# EAGLE design Timer-Ruler_v2 (EAGLE 7.4.0)
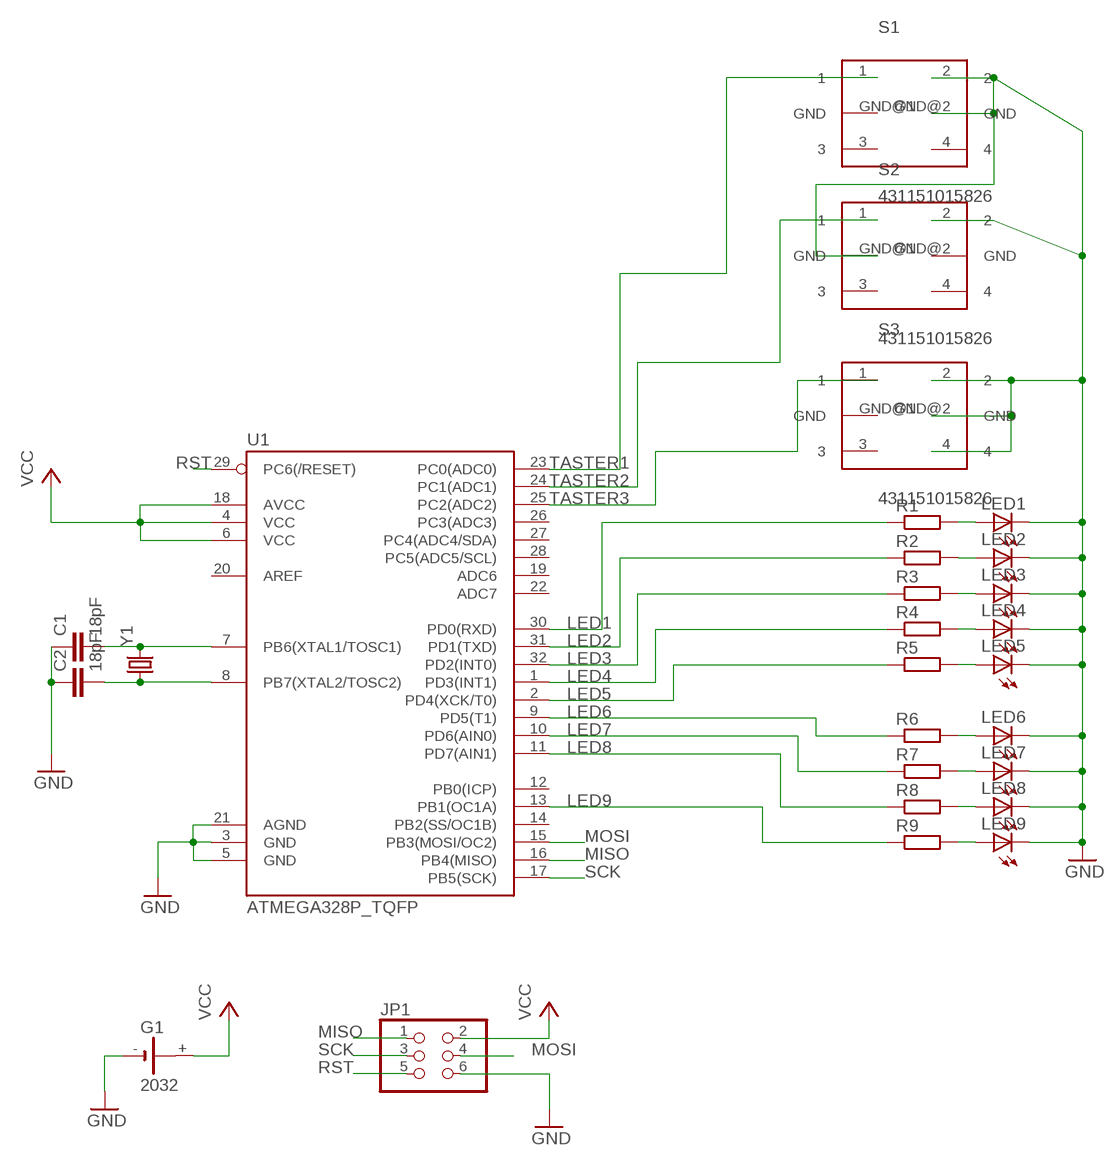
[diagram p0: schematic, sheet 1]

## Parts
C1  18pF  C-EUC0805K  [C0805K]
C2  18pF  C-EUC0805K  [C0805K]
G1  2032  [KZH20SMD]
JP1  PINHD-2X3  [2X03]
LED1  LEDCHIP-LED0805  [CHIP-LED0805]
LED2  LEDCHIP-LED0805  [CHIP-LED0805]
LED3  LEDCHIP-LED0805  [CHIP-LED0805]
LED4  LEDCHIP-LED0805  [CHIP-LED0805]
LED5  LEDCHIP-LED0805  [CHIP-LED0805]
LED6  LEDCHIP-LED0805  [CHIP-LED0805]
LED7  LEDCHIP-LED0805  [CHIP-LED0805]
LED8  LEDCHIP-LED0805  [CHIP-LED0805]
LED9  LEDCHIP-LED0805  [CHIP-LED0805]
R1  R-EU_R0805  [R0805]
R2  R-EU_R0805  [R0805]
R3  R-EU_R0805  [R0805]
R4  R-EU_R0805  [R0805]
R5  R-EU_R0805  [R0805]
R6  R-EU_R0805  [R0805]
R7  R-EU_R0805  [R0805]
R8  R-EU_R0805  [R0805]
R9  R-EU_R0805  [R0805]
S1  431151015826  [431181015816]
S2  431151015826  [431181015816]
S3  431151015826  [431181015816]
U1  ATMEGA328P_TQFP  [TQFP32-08]
Y1  CRYSTALSMD  [HC49UP]

## Nets
GND: C1.1 C2.1 G1.- JP1.6 LED1.C LED2.C LED3.C LED4.C LED5.C LED6.C LED7.C LED8.C LED9.C S1.2 S1.GND@2(GND) S2.2 S2.GND@1(GND) S3.2 S3.4 S3.GND@2(GND) U1.3(GND) U1.5(GND) U1.21(AGND)
LED1: R1.1 U1.30(PD0(RXD))
LED2: R2.1 U1.31(PD1(TXD))
LED3: R3.1 U1.32(PD2(INT0))
LED4: R4.1 U1.1(PD3(INT1))
LED5: R5.1 U1.2(PD4(XCK/T0))
LED6: R6.1 U1.9(PD5(T1))
LED7: R7.1 U1.10(PD6(AIN0))
LED8: R8.1 U1.11(PD7(AIN1))
LED9: R9.1 U1.13(PB1(OC1A))
MISO: JP1.1 U1.16(PB4(MISO))
MOSI: JP1.4 U1.15(PB3(MOSI/OC2))
N$1: LED1.A R1.2
N$2: LED2.A R2.2
N$3: LED3.A R3.2
N$4: LED4.A R4.2
N$5: LED5.A R5.2
N$6: LED6.A R6.2
N$7: LED7.A R7.2
N$8: LED8.A R8.2
N$9: LED9.A R9.2
N$10: C1.2 U1.7(PB6(XTAL1/TOSC1)) Y1.2
N$11: C2.2 U1.8(PB7(XTAL2/TOSC2)) Y1.1
RST: JP1.5 U1.29(PC6(/RESET))
SCK: JP1.3 U1.17(PB5(SCK))
TASTER1: S1.1 U1.23(PC0(ADC0))
TASTER2: S2.1 U1.24(PC1(ADC1))
TASTER3: S3.1 U1.25(PC2(ADC2))
VCC: G1.+ JP1.2 U1.4(VCC) U1.6(VCC) U1.18(AVCC)
Unconnected: S1.3 S1.4 S1.GND@1(GND) S2.3 S2.4 S2.GND@2(GND) S3.3 S3.GND@1(GND) U1.12(PB0(ICP)) U1.14(PB2(SS/OC1B)) U1.19(ADC6) U1.20(AREF) U1.22(ADC7) U1.26(PC3(ADC3)) U1.27(PC4(ADC4/SDA)) U1.28(PC5(ADC5/SCL))

## Library data of the parts
C1 C2 = resistor:C-EU: CAPACITOR, European symbol
G1 = kzh20_lithium_batterie_holder:2032
JP1 = pinhead:PINHD-2X3: PIN HEADER
LED1-LED9 = led:LED: LED OSRAM: - CHIPLED LG R971, LG N971, LY N971, LG Q971, LY Q971, LO R971, LY R971 LH N974, LH R974 LS Q976, LO Q976, LY Q976 LO Q996 - Hyper CHIPLED LW Q18S LB Q993, LB Q99A, LB R99A - SideLED LS A670, LO A670, LY A670, LG A670, LP A670 LB A673, LV A673, LT A673, LW A673 LH A674 LY A675 LS A676, LA A676, LO A676, LY A676, LW A676 LS A679, LY A679, LG A679 - Hyper Micro SIDELED® LS Y876, LA Y876, LO Y876, LY Y876 LT Y87S - SmartLED LW L88C, LW L88S LB L89C, LB L89S, LG L890 LS L89K, LO L89K, LY L89K LS L896, LA L896, LO L896, LY L896 - TOPLED LS T670, LO T670, LY T670, LG T670, LP T670 LSG T670, LSP T670, LSY T670, LOP T670, LYG T670 LG T671, LOG T671, LSG T671 LB T673, LV T673, LT T673, LW T673 LH T674 LS T676, LA T676, LO T676, LY T676, LB T676, LH T676, LSB T676, LW T676 LB T67C, LV T67C, LT T67C, LS T67K, LO T67K, LY T67K, LW E67C LS E67B, LA E67B, LO E67B, LY E67B, LB E67C, LV E67C, LT E67C LW T67C LS T679, LY T679, LG T679 LS T770, LO T770, LY T770, LG T770, LP T770 LB T773, LV T773, LT T773, LW T773 LH T774 LS E675, LA E675, LY E675, LS T675 LS T776, LA T776, LO T776, LY T776, LB T776 LHGB T686 LT T68C, LB T68C - Hyper Mini TOPLED® LB M676 - Mini TOPLED Santana® LG M470 LS M47K, LO M47K, LY M47K Source: http://www.osram.convergy.de LUXEON: - LUMILED® LXK2-PW12-R00, LXK2-PW12-S00, LXK2-PW14-U00, LXK2-PW14-V00 LXK2-PM12-R00, LXK2-PM12-S00, LXK2-PM14-U00 LXK2-PE12-Q00, LXK2-PE12-R00, LXK2-PE12-S00, LXK2-PE14-T00, LXK2-PE14-U00 LXK2-PB12-K00, LXK2-PB12-L00, LXK2-PB12-M00, LXK2-PB14-N00, LXK2-PB14-P00, LXK2-PB14-Q00 LXK2-PR12-L00, LXK2-PR12-M00, LXK2-PR14-Q00, LXK2-PR14-R00 LXK2-PD12-Q00, LXK2-PD12-R00, LXK2-PD12-S00 LXK2-PH12-R00, LXK2-PH12-S00 LXK2-PL12-P00, LXK2-PL12-Q00, LXK2-PL12-R00 Source: www.luxeon.com KINGBRIGHT: KA-3528ASYC Source: www.kingbright.com
R1-R9 = resistor:R-EU_: RESISTOR, European symbol
S1-S3 = Wurth_Elektronik_Electromechanic_Switchs_rev15b:431151015826: WS-TSS-5x5 mm SMD Tact Switch with ground terminal, 4 pins
U1 = SparkFun-DigitalIC:ATMEGA328P_TQFP; PROD_ID: IC-09069
Y1 = SparkFun-FreqCtrl:CRYSTAL: Various standard crystals. Proven footprints.

## Board
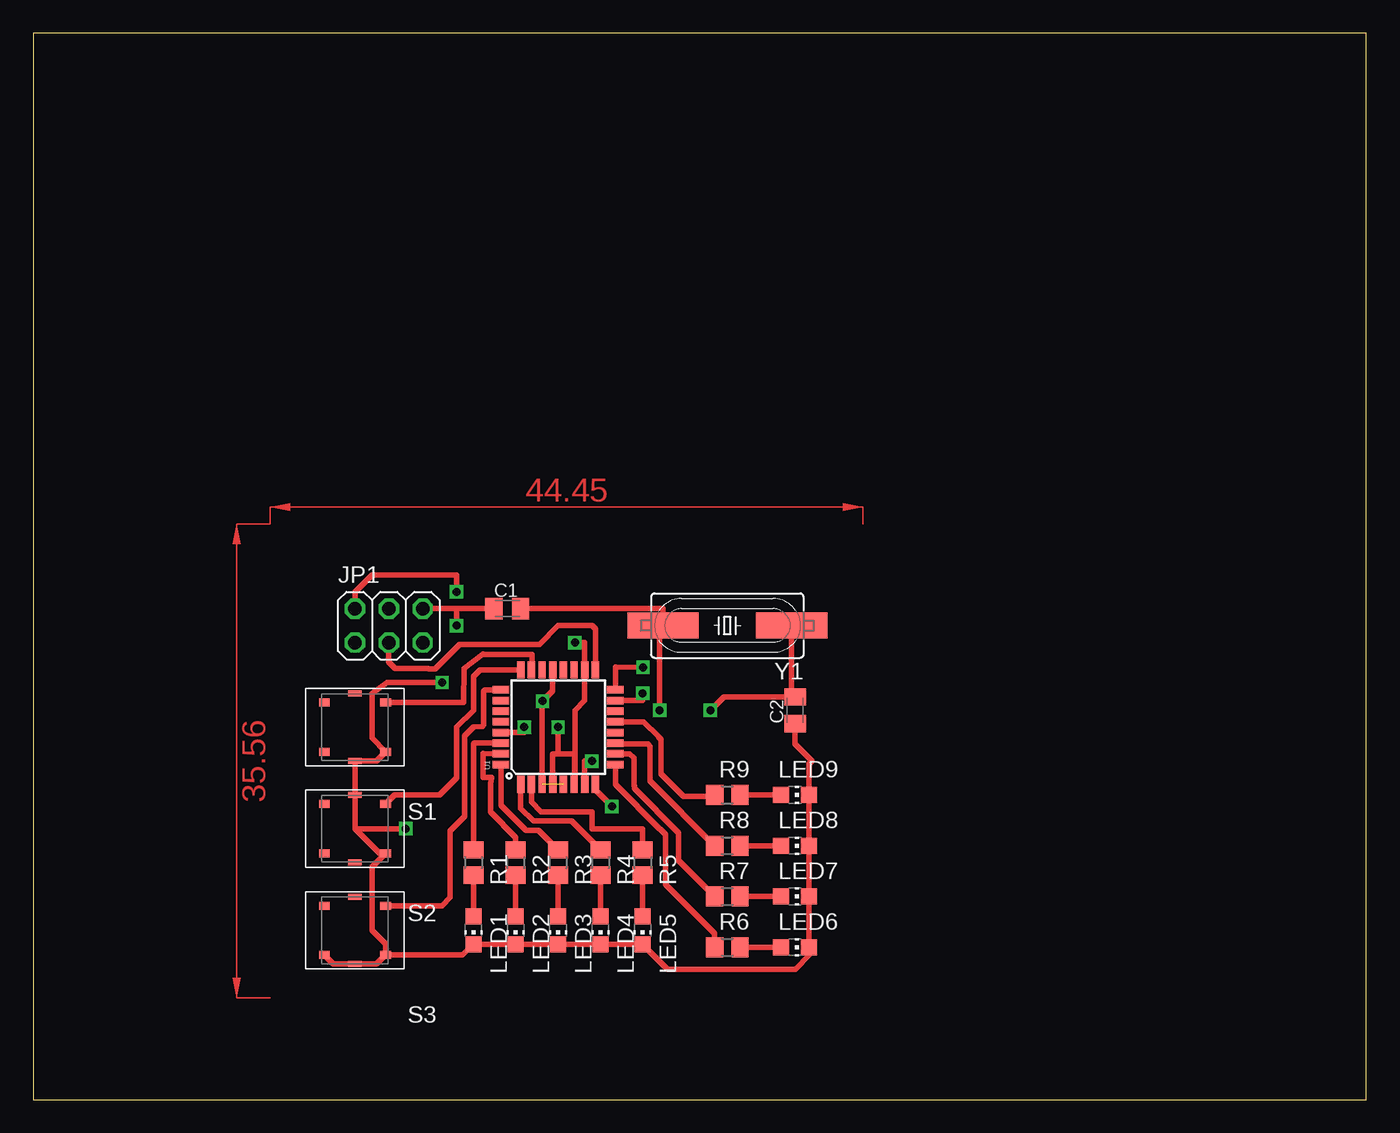
[diagram p1: board, top side]
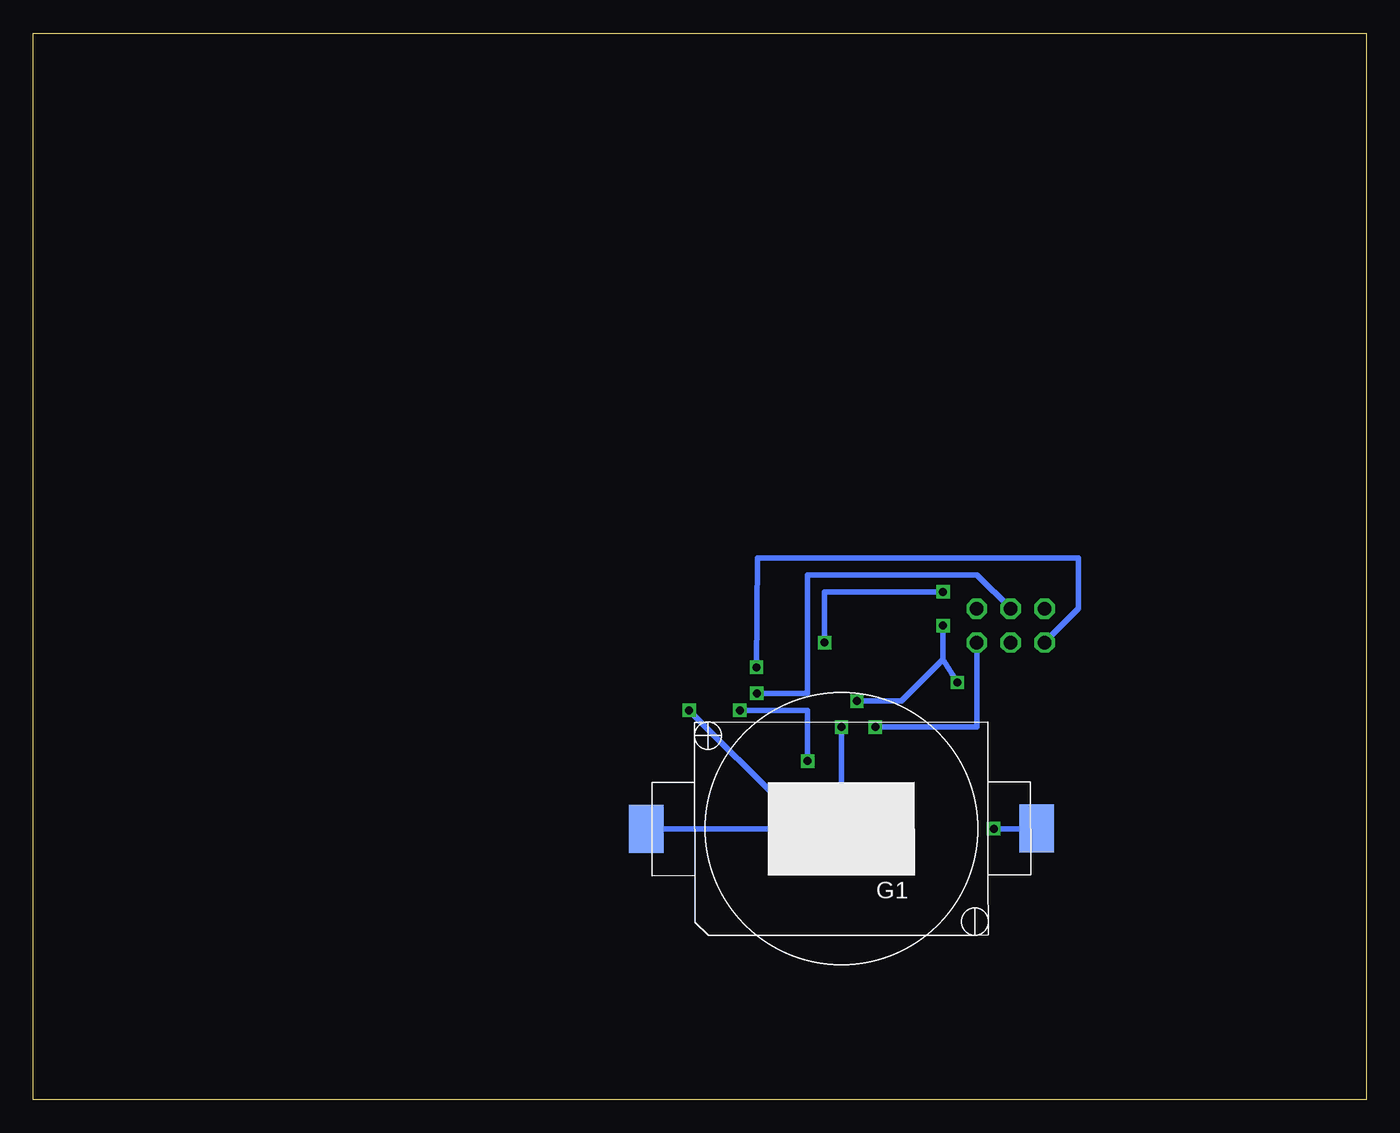
[diagram p2: board, bottom side, seen from below]

Size 100 x 80 mm. Coordinates in mm from the lower left corner, seen from the top.
Outline: 0,0 100,0 100,80 0,80 0,0
Copper layers (1*16): Top 0.035mm / dielectric 1.5mm / Bottom 0.035mm
Design rules "default *": minimum track width 0.4mm, minimum drill 24mil, track to track 0.4mm, track to pad 0.4mm, pad to pad 0.4mm, via to via 0.4mm, smd to smd 0.4mm, copper to edge 40mil, drill to drill 8mil, minimum pad ring 10mil, minimum via ring 8mil, stop-mask expansion 4mil, vias tented up to drill 0mil, thermal gap 10mil

### Footprints (pad centres in the part's own frame; a part is rotated, then mirrored left to right if it is on the bottom)
C0805K = smd 1.3 x 1.6: 1 -1,0; 2 1,0
KZH20SMD = smd 2.6 x 3.6: + 14.65,0; - -14.65,0
2X03 = drill 1.016 octagon: 1 -2.54,-1.27; 2 -2.54,1.27; 3 0,-1.27; 4 0,1.27; 5 2.54,-1.27; 6 2.54,1.27
CHIP-LED0805 = smd 1.2 x 1.2: A 0,-1.05; C 0,1.05
R0805 = smd 1.3 x 1.5: 1 -0.95,0; 2 0.95,0
431181015816 = smd 0.8 x 0.6: 1 -2.3,-1.85; 2 -2.3,1.85; 3 2.3,-1.85; 4 2.3,1.85 | smd 1 x 0.45: GND@1 0,-2.525; GND@2 0,2.525
TQFP32-08 = smd 1.27 x 0.559: 1 -4.293,2.8; 2 -4.293,2; 3 -4.293,1.2; 4 -4.293,0.4; 5 -4.293,-0.4; 6 -4.293,-1.2; 7 -4.293,-2; 8 -4.293,-2.8; 17 4.293,-2.8; 18 4.293,-2; 19 4.293,-1.2; 20 4.293,-0.4; 21 4.293,0.4; 22 4.293,1.2; 23 4.293,2; 24 4.293,2.8 | smd 0.559 x 1.27: 9 -2.8,-4.293; 10 -2,-4.293; 11 -1.2,-4.293; 12 -0.4,-4.293; 13 0.4,-4.293; 14 1.2,-4.293; 15 2,-4.293; 16 2.8,-4.293; 25 2.8,4.293; 26 2,4.293; 27 1.2,4.293; 28 0.4,4.293; 29 -0.4,4.293; 30 -1.2,4.293; 31 -2,4.293; 32 -2.8,4.293
HC49UP = smd 5.334 x 1.93: 1 -4.826,0; 2 4.826,0

### Placement (x,y rotation side)
C1  35.56,36.83 0 top
C2  57.15,29.21 90 top
G1  39.37,20.32 180.1 bottom
JP1  26.67,35.56 0 top
LED1  33.02,12.7 180 top
LED2  36.2,12.7 180 top
LED3  39.37,12.7 180 top
LED4  42.55,12.7 180 top
LED5  45.72,12.7 180 top
LED6  57.15,11.43 270 top
LED7  57.15,15.24 270 top
LED8  57.15,19.05 270 top
LED9  57.15,22.86 270 top
R1  33.02,17.78 270 top
R2  36.2,17.78 270 top
R3  39.37,17.78 270 top
R4  42.55,17.78 270 top
R5  45.72,17.78 270 top
R6  52.07,11.43 0 top
R7  52.07,15.24 0 top
R8  52.07,19.05 0 top
R9  52.07,22.86 0 top
S1  24.13,27.94 180 top
S2  24.13,20.32 180 top
S3  24.13,12.7 180 top
U1  39.37,27.94 90 top
Y1  52.07,35.56 180 top

### Tracks (layer width: path | path; a pad name or v marks a point on that pad's centre or on a via)
GND  (via drill 0.6)  (1 unrouted)
  Top 0.406: C2.1 57.15,26.67 58.42,25.4 58.2,25.18 LED9.C LED8.C LED7.C LED6.C 58.2,10.81 57.17,9.78 47.59,9.78 LED5.C LED4.C LED3.C LED2.C LED1.C 32.22,10.85 S3.2 | S3.2 25.75,10.18 S3.GND@2 22.5,10.18 S3.4 | S3.2 26.43,11.67 25.4,12.7 25.4,17.44 S2.2 25.98,18.47 24.13,20.32 | 24.13,20.32 S2.GND@1 S1.GND@2 25.75,25.41 S1.2 25.4,27.12 25.4,30.48 26.55,31.29 v30.67,31.29 | C1.1 31.75,36.83 | 31.75,36.83 JP1.6 | v31.75,35.56 31.75,36.83 | v27.94,20.32 24.13,20.32 | U1.21 38.97,30.66 v38.21,29.9 38.17,29.86 U1.3
  Bottom 0.406: v30.67,31.29 31.75,33.02 | 31.75,33.02 v31.75,35.56 | G1.- 24.75,20.32 v27.94,20.32 | v38.21,29.9 34.87,29.9 31.75,33.02
LED1
  Top 0.406: R1.1 33.02,26.67 33.09,26.74 U1.30
LED2
  Top 0.406: R2.1 36.2,19.68 34.29,21.59 34.29,23.67 34.36,24.16 33.74,24.16 33.73,25.26 33.73,25.98 35.22,25.94 U1.31
LED3
  Top 0.406: R3.1 37.92,20.18 36.98,20.18 35.08,22.08 U1.32
LED4
  Top 0.406: U1.1 36.57,21.85 37.53,20.89 40.39,20.89 R4.1
LED5
  Top 0.406: U1.2 37.37,22.32 38.1,21.59 41.91,21.59 41.91,20.32 45.72,20.32 R5.1
LED6
  Top 0.406: U1.9 43.66,23.65 46.99,20.32 47,20.32 47.43,19.89 47.43,16.14 51.12,12.45 R6.1
LED7
  Top 0.406: U1.10 44.75,25.94 45.06,25.63 45.06,23.56 45.1,23.53 45.1,23.33 48.42,20.01 48.42,17.94 R7.1
LED8
  Top 0.406: U1.11 43.73,26.67 46.12,26.67 46.28,26.51 46.28,23.89 R8.1
LED9
  Top 0.406: U1.13 45.79,28.34 46.89,27.24 46.89,27.2 47.09,27.01 47.09,24.44 48.77,22.76 51.02,22.76 R9.1
MISO  (via drill 0.6)
  Top 0.406: U1.16 43.66,32.44 v45.75,32.43
  Bottom 0.406: v45.75,32.43 45.67,40.62 43.18,40.64 21.59,40.64 21.59,36.83 JP1.1
MOSI  (via drill 0.6)
  Top 0.406: U1.15 45.72,29.94 v45.72,30.48
  Bottom 0.406: v45.72,30.48 41.91,30.48 41.91,39.37 29.21,39.37 JP1.4
N$1
  Top 0.406: R1.2 LED1.A
N$2
  Top 0.406: R2.2 LED2.A
N$3
  Top 0.406: R3.2 LED3.A
N$4
  Top 0.406: R4.2 LED4.A
N$5
  Top 0.406: R5.2 LED5.A
N$6
  Top 0.406: R6.2 LED6.A
N$7
  Top 0.406: R7.2 LED7.A
N$8
  Top 0.406: R8.2 LED8.A
N$9
  Top 0.406: R9.2 LED9.A
N$10  (via drill 0.6)
  Top 0.406: U1.7 41.37,25.4 v41.91,25.4 | v46.99,29.21 46.99,35.56 Y1.2 47.24,36.83 C1.2
  Bottom 0.406: v41.91,25.4 41.91,29.21 v46.99,29.21
N$11  (via drill 0.6)
  Top 0.406: Y1.1 56.9,30.46 C2.2 51.8,30.21 v50.8,29.21 | U1.8 42.17,23.23 v43.41,21.99
  Bottom 0.406: v43.41,21.99 43.58,21.99 v50.8,29.21
RST  (via drill 0.6)
  Top 0.406: U1.29 36.83,27.54 v36.83,27.94
  Bottom 0.406: v36.83,27.94 29.21,27.94 JP1.5
SCK
  Top 0.406: JP1.3 26.67,32.85 27.16,32.36 29.61,32.36 29.64,32.32 30.14,32.32 31.98,34.16 37.97,34.16 39.37,35.56 41.91,35.56 42.17,35.3 U1.17
TASTER1
  Top 0.406: S1.1 32.28,29.79 32.32,32.36 33.74,33.43 33.74,33.4 37.41,33.4 37.41,32.23 U1.23
TASTER2
  Top 0.406: S2.1 27.12,22.86 30.48,22.86 31.75,24.13 31.75,27.94 33.02,29.21 33.02,31.75 33.5,32.23 U1.24
TASTER3
  Top 0.406: S3.1 30.67,14.55 31.27,15.15 31.27,20.16 32.37,21.26 32.37,27.29 33.02,27.94 33.7,28.01 33.79,28.1 33.79,30.63 33.91,30.74 U1.25
VCC  (via drill 0.6)
  Top 0.406: 39.37,25.92 40.54,25.92 40.61,25.85 40.61,23.68 U1.6 40.64,23.72 40.64,29.21 41.37,29.94 U1.18 41.37,34.29 v40.64,34.29 | 39.37,25.92 38.98,25.92 38.97,25.91 U1.4 | v31.75,38.1 31.75,39.37 25.4,39.37 24.13,38.1 JP1.2 | v39.37,27.94 39.37,25.92
  Bottom 0.406: v40.64,34.29 40.64,38.1 v31.75,38.1 | G1.+ 53.99,20.32 39.37,20.32 v39.37,27.94
(copper drawn outside any net)
  shapes: Top area x2